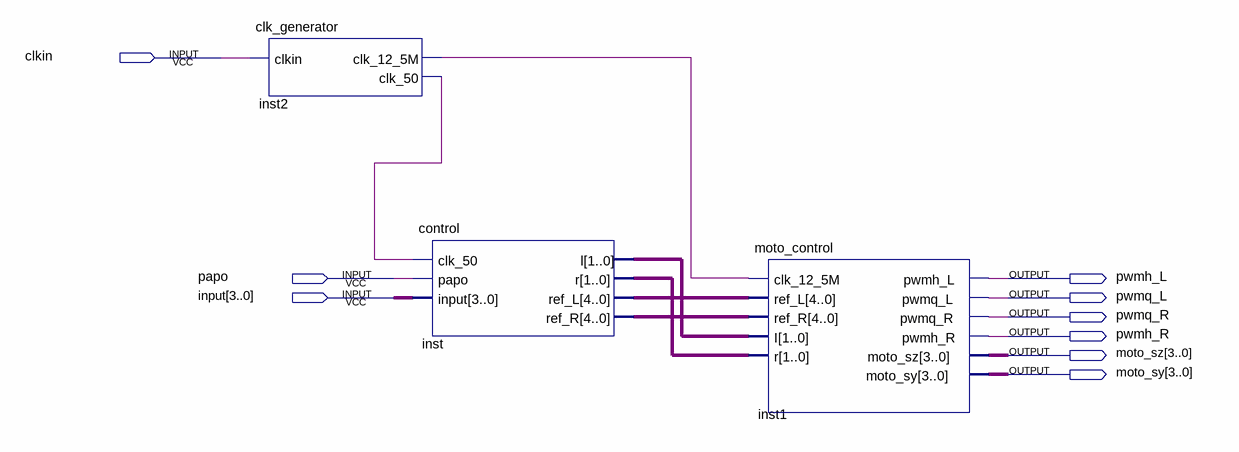
[diagram p0: schematic sheet]
// Quartus schematic xiaoche.bdf as structural Verilog: 3 symbols, 9 pins
module xiaoche (
  input  clkin,
  input  papo,
  input  [3:0] \input ,
  output pwmh_L,
  output pwmq_L,
  output pwmq_R,
  output pwmh_R,
  output [3:0] moto_sz,
  output [3:0] moto_sy
);

  wire inst2_clk_12_5m, inst2_clk_50;
  wire [1:0] inst_l, inst_r;
  wire [4:0] inst_ref_l, inst_ref_r;

  clk_generator inst2 (.clkin(clkin), .clk_12_5M(inst2_clk_12_5m), .clk_50(inst2_clk_50));
  control inst (
    .clk_50(inst2_clk_50), .papo(papo), .\input (\input ), .l(inst_l), .r(inst_r), .ref_L(inst_ref_l),
    .ref_R(inst_ref_r));
  moto_control inst1 (
    .clk_12_5M(inst2_clk_12_5m), .ref_L(inst_ref_l), .ref_R(inst_ref_r), .I(inst_l), .r(inst_r),
    .pwmh_L(pwmh_L), .pwmq_L(pwmq_L), .pwmq_R(pwmq_R), .pwmh_R(pwmh_R), .moto_sz(moto_sz), .moto_sy(moto_sy));
endmodule
